# EAGLE design Adafruit ST7565 (EAGLE 7.2.0)
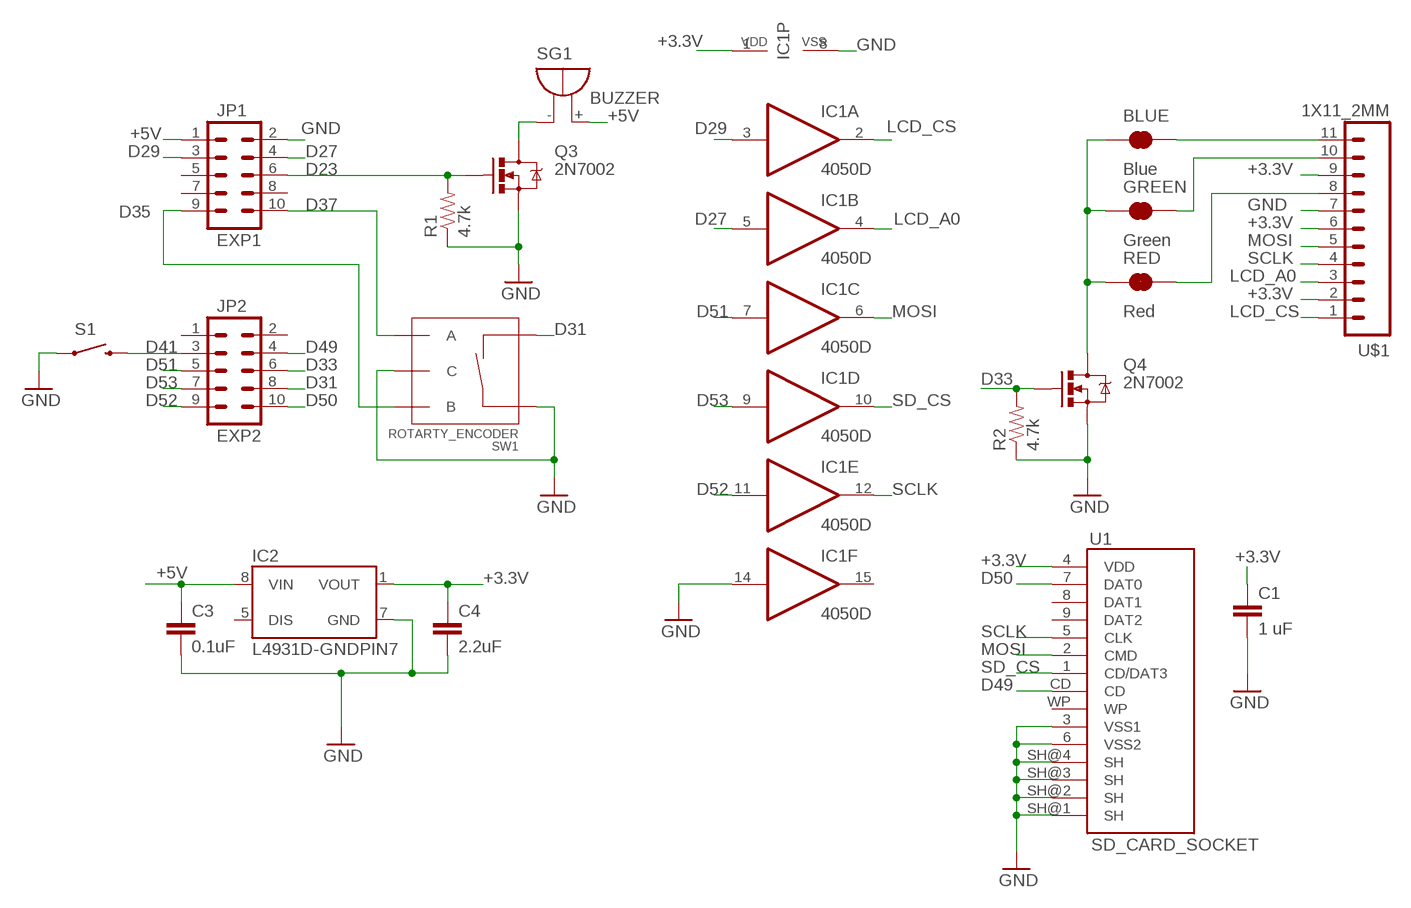
[diagram p0: schematic, sheet 1]

## Parts
BLUE  Blue  JUMPER-PAD-2-NC_BY_TRACE  [PAD-JUMPER-2-NC_BY_TRACE_YES_SILK]
C1  1 uF  CAP1206  [1206]
C3  0.1uF  CAP1206  [1206]
C4  2.2uF  CAP1206  [1206]
GREEN  Green  JUMPER-PAD-2-NC_BY_TRACE  [PAD-JUMPER-2-NC_BY_TRACE_YES_SILK]
IC1  4050D  [SO16]
IC2  L4931D-GNDPIN7  [SO08]
JP1  EXP1  M05X2SHD  [2X5-SHROUDED]
JP2  EXP2  M05X2SHD  [2X5-SHROUDED]
Q3  2N7002  MOSFET-NCHANNELBSS123LT1G  [SOT23-3]
Q4  2N7002  MOSFET-NCHANNELBSS123LT1G  [SOT23-3]
R1  4.7k  RESISTOR1206  [1206]
R2  4.7k  RESISTOR1206  [1206]
RED  Red  JUMPER-PAD-2-NC_BY_TRACE  [PAD-JUMPER-2-NC_BY_TRACE_YES_SILK]
S1  SWITCH-MOMENTARY-2PTH  [TACTILE-PTH]
SG1  BUZZER  [F/QMBIII]
SW1  ROTARTY_ENCODER  [ROTARY_ENC_PLAIN]
U1  SD_CARD_SOCKET  [SD_1:1]
U$1  1X11_2MM  [1X11_2MM]

## Nets
+3.3V: C1.1 C4.1 IC1.1(P:VDD) IC2.1(VOUT) U1.4(VDD) U$1.2 U$1.6 U$1.9
+5V: C3.1 IC2.8(VIN) JP1.1 SG1.+(-)
D23: JP1.6 Q3.1(G) R1.2
D27: IC1.5(B:I) JP1.4
D29: IC1.3(A:I) JP1.3
D31: JP2.8 SW1.SW-
D33: JP2.6 Q4.1(G) R2.2
D35: JP1.9 SW1.B
D37: JP1.10 SW1.A
D41: JP2.3 S1.3
D49: JP2.4 U1.CD
D50: JP2.10 U1.7(DAT0)
D51: IC1.7(C:I) JP2.5
D52: IC1.11(E:I) JP2.9
D53: IC1.9(D:I) JP2.7
GND: C1.2 C3.2 C4.2 IC1.8(P:VSS) IC1.14(F:I) IC2.7(GND) JP1.2 Q3.2(S) Q4.2(S) R1.1 R2.1 S1.1 SW1.C SW1.SW+ U1.3(VSS1) U1.6(VSS2) U1.SH@1(SH) U1.SH@2(SH) U1.SH@3(SH) U1.SH@4(SH) U$1.7
LCD_A0: IC1.4(B:O) U$1.3
LCD_CS: IC1.2(A:O) U$1.1
MOSI: IC1.6(C:O) U1.2(CMD) U$1.5
N$1: Q3.3(D) SG1.-(+)
N$2: BLUE.1 GREEN.1 Q4.3(D) RED.1
N$5: RED.2 U$1.8
N$6: GREEN.2 U$1.10
N$7: BLUE.2 U$1.11
SCLK: IC1.12(E:O) U1.5(CLK) U$1.4
SD_CS: IC1.10(D:O) U1.1(CD/DAT3)
Unconnected: IC1.15(F:O) IC2.5(DIS) JP1.5 JP1.7 JP1.8 JP2.1 JP2.2 U1.8(DAT1) U1.9(DAT2) U1.WP

## Library data of the parts
BLUE GREEN RED = SparkFun-Passives:JUMPER-PAD-2-NC_BY_TRACE
C1 C3 C4 = SparkFun-Passives:CAP: Capacitor Standard 0603 ceramic capacitor, and 0.1" leaded capacitor.
IC1 = 40xx:4050: Hex non-inverting BUFFER
IC2 = v-reg-3:L4931: STMicroelectronics <http://www.st.com> 250mA low dropout voltage regulator Vin 5V to 28V (transients 40V), disable pin, 50µA shutdown current
JP1 JP2 = SparkFun-Connectors:M05X2: Header 5x2 Standard 10-pin dual row 0.1" header. Commonly used with AVR-ISP. Use with Spark Fun Electronics SKU: PRT-00778
Q3 Q4 = SparkFun-DiscreteSemi:MOSFET-NCHANNEL: Common NMOSFET Parts MFG P/N Store ID Prod ID FDD8780 TRANS-09984 SI7820DN TRANS-11055 FDS6630A IC-08089 2N7002PW TRANS-11151 FQP30N06L COM-10213 TRANS-10060 BSS123LT1G TRANS-08345 BSS138 TRANS-00830 BS170 2N7000; PROD_ID: TRANS-08345
R1 R2 = SparkFun-Passives:RESISTOR: Resistor Basic schematic elements and footprints for 0603, 1206, and PTH resistors.
S1 = SparkFun-Electromechanical:SWITCH-MOMENTARY-2: Various NO switches- pushbuttons, reed, etc
SG1 = elb:BUZZER: BUZZER Source: Buerklin; OC_FARNELL: unknown; OC_NEWARK: unknown
SW1 = elb:ROTARTY_ENCODER: Simple no LED rotary encoder Example: COM-09117
U1 = elb:SD_CARD_SOCKET: SD Memory Card Connector, push-push normal type, CD enable, WP enable
U$1 = elb:1X11_2MM: !11-pin single row 2mm header

## Board
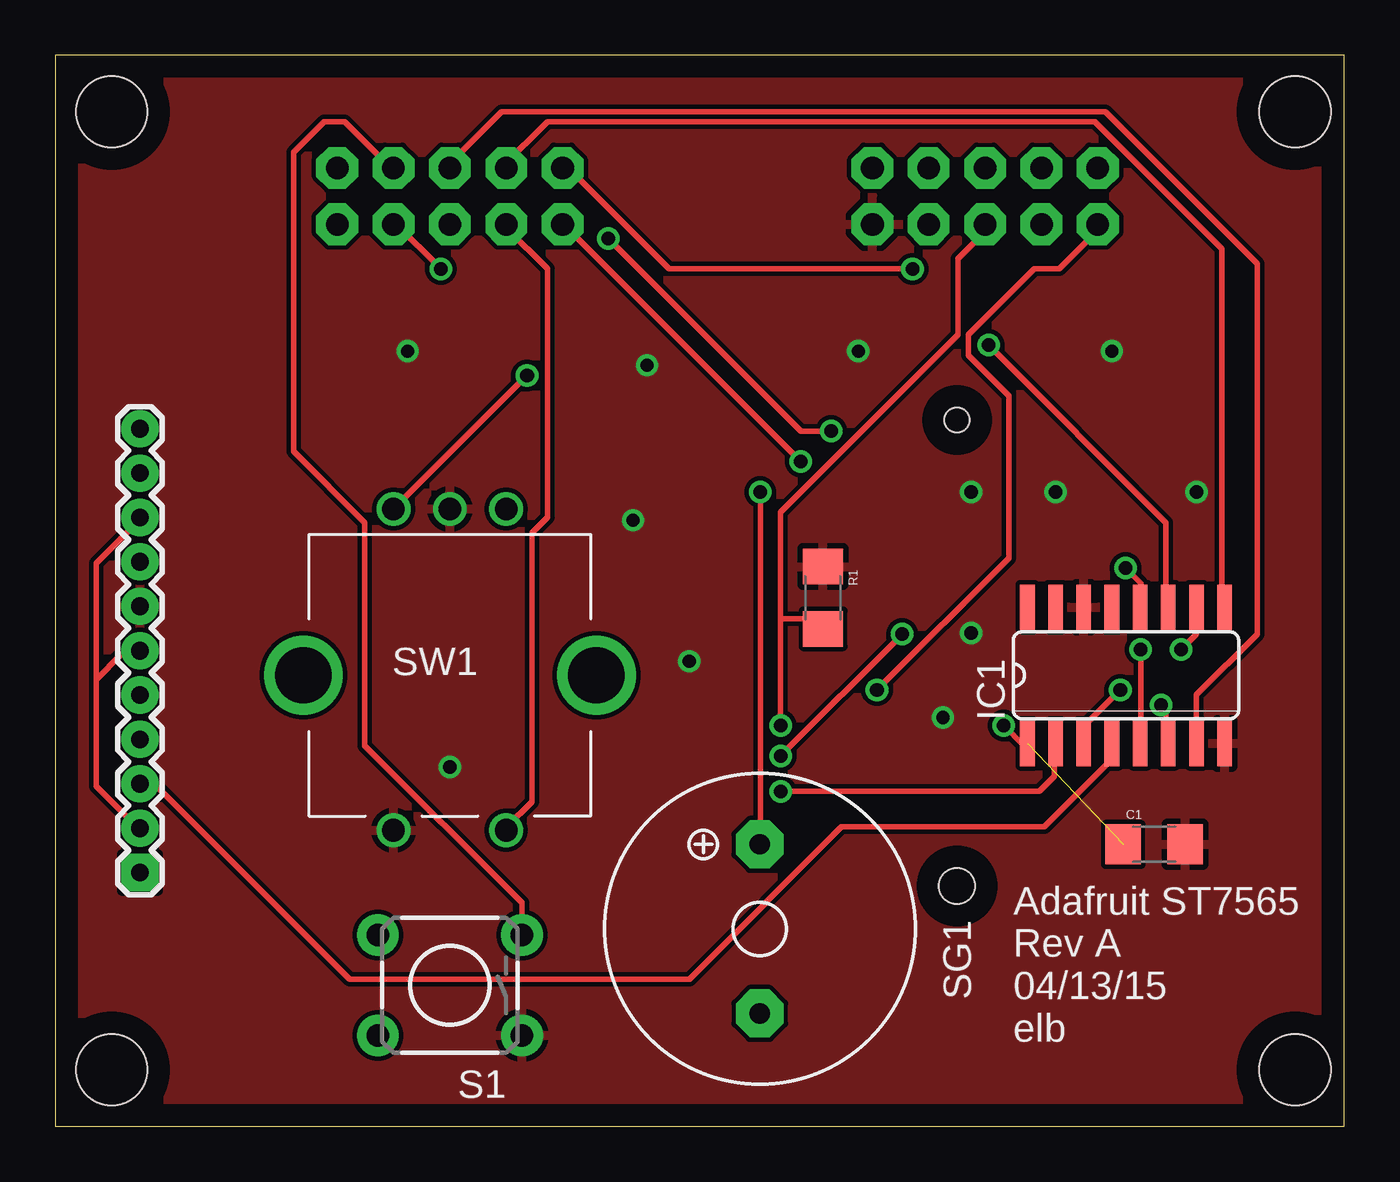
[diagram p1: board, top side]
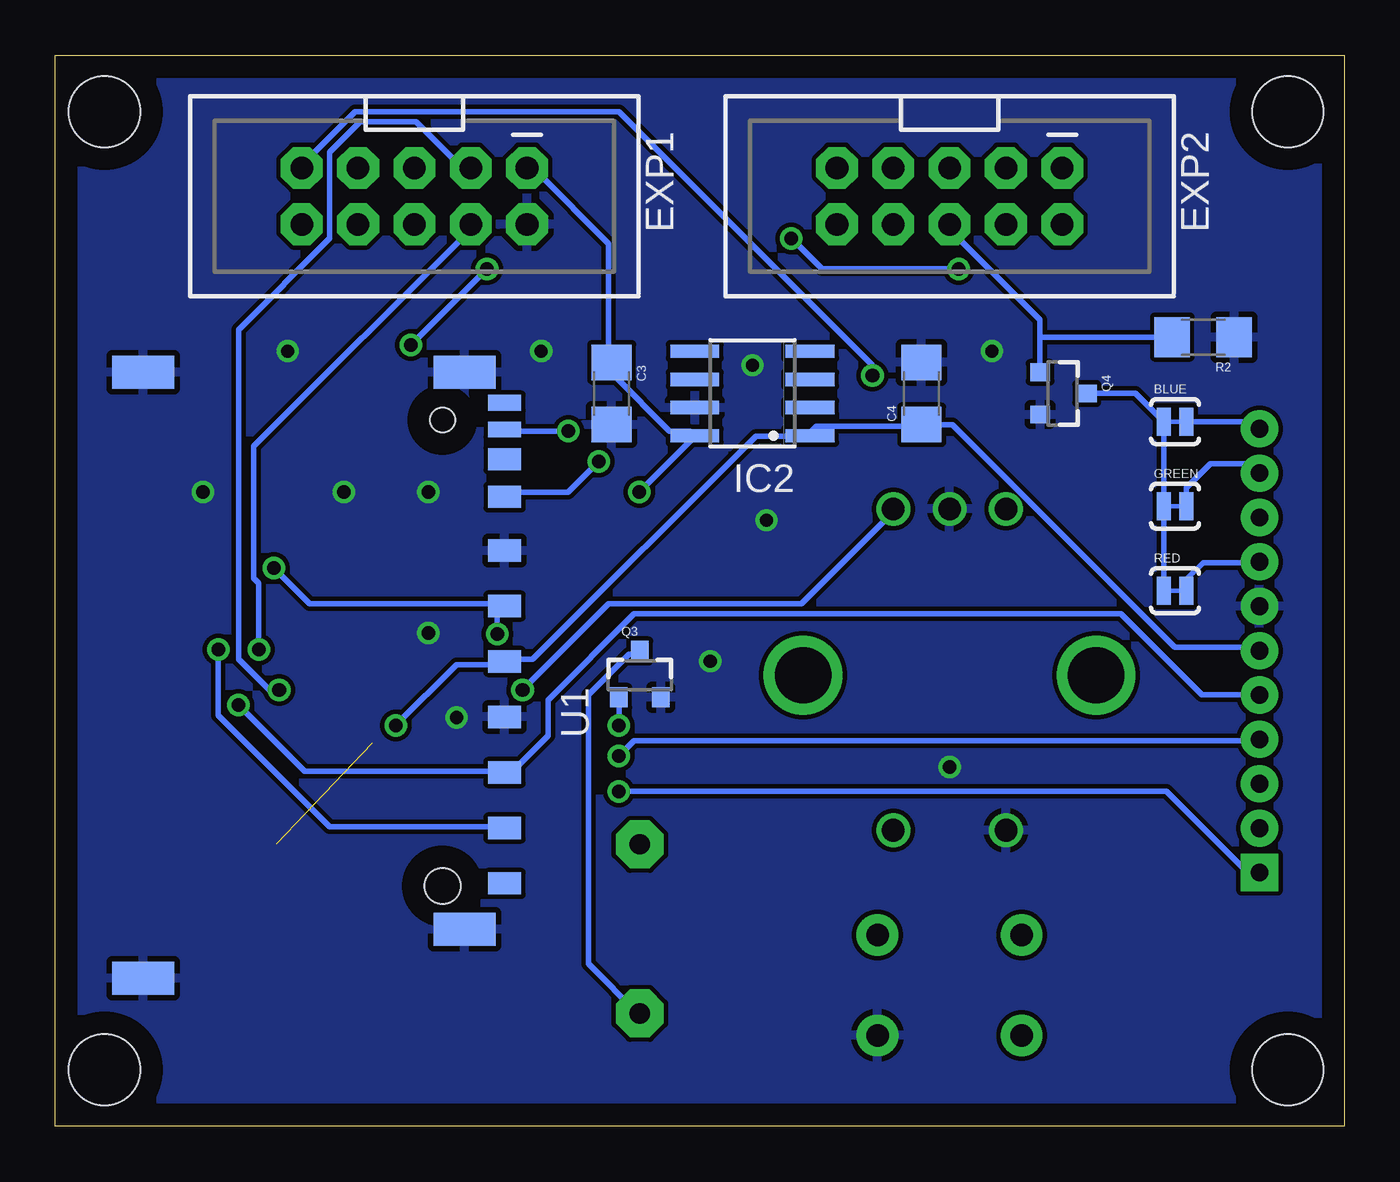
[diagram p2: board, bottom side, seen from below]

Size 58.09 x 48.25 mm. Coordinates in mm from the lower left corner, seen from the top.
Outline: 0,0 58.09,0 58.09,48.25 0,48.25 0,0
Copper layers (1*16): Top 0.035mm / dielectric 1.5mm / Bottom 0.035mm
Design rules "default": minimum track width 10mil, minimum drill 24mil, track to track 8mil, track to pad 8mil, pad to pad 8mil, via to via 8mil, smd to smd 8mil, copper to edge 40mil, drill to drill 8mil, minimum pad ring 10mil, minimum via ring 8mil, stop-mask expansion 4mil, vias tented up to drill 0mil, thermal gap 10mil
Holes 3.2 mm at 2.54,45.72 2.54,2.54 55.88,2.54 55.88,45.72

### Footprints (pad centres in the part's own frame; a part is rotated, then mirrored left to right if it is on the bottom)
PAD-JUMPER-2-NC_BY_TRACE_YES_SILK = smd 0.635 x 1.27: 1 -0.508,0; 2 0.508,0
1206 = smd 1.6 x 1.8: 1 -1.4,0; 2 1.4,0
SO16 = smd 0.66 x 2.032: 1 -4.445,-3.073; 2 -3.175,-3.073; 3 -1.905,-3.073; 4 -0.635,-3.073; 5 0.635,-3.073; 6 1.905,-3.073; 7 3.175,-3.073; 8 4.445,-3.073; 9 4.445,3.073; 10 3.175,3.073; 11 1.905,3.073; 12 0.635,3.073; 13 -0.635,3.073; 14 -1.905,3.073; 15 -3.175,3.073; 16 -4.445,3.073
SO08 = smd 0.6 x 2.2: 1 -1.905,-2.6; 2 -0.635,-2.6; 3 0.635,-2.6; 4 1.905,-2.6; 5 1.905,2.6; 6 0.635,2.6; 7 -0.635,2.6; 8 -1.905,2.6
2X5-SHROUDED = drill 1.016 pad 1.88 octagon: 1 -1.27,5.08; 2 1.27,5.08; 3 -1.27,2.54; 4 1.27,2.54; 5 -1.27,0; 6 1.27,0; 7 -1.27,-2.54; 8 1.27,-2.54; 9 -1.27,-5.08; 10 1.27,-5.08
SOT23-3 = smd 0.8 x 0.9: 1 -0.95,-1; 2 0.95,-1; 3 0,1.1
TACTILE-PTH = drill 1.016 pad 1.88: 1 -3.251,2.261; 2 3.251,2.261; 3 -3.251,-2.261; 4 3.251,-2.261
F/QMBIII = drill 0.914 pad 2.159 octagon: + 3.81,0; - -3.81,0
ROTARY_ENC_PLAIN = drill 1.016: A 7.493,-2.54; B 7.493,2.54; C 7.493,0; SW+ -6.985,2.54; SW- -6.985,-2.54 | drill 2.54: P$3 0,6.604; P$4 0,-6.604
SD_1:1 = smd 1 x 1.5: 1 6.88,2.8; 2 4.38,2.8; 3 1.88,2.8; 4 -0.62,2.8; 5 -3.12,2.8; 6 -5.62,2.8; 7 -8.04,2.8; 8 -9.74,2.8; 9 9.38,2.8 | smd 0.7 x 1.5: CD -11.08,2.8; WP -12.28,2.8 | smd 1.5 x 2.8: SH@1 11.45,1; SH@2 -13.65,-13.5; SH@3 13.65,-13.5; SH@4 -13.65,1 | hole 1.6: 9.5,0 | hole 1.1: -11.5,0
1X11_2MM = drill 0.8 pad 1.676 square: 1 0,0 | drill 0.8 pad 1.676: 2 2,0; 3 4,0; 4 6,0; 5 8,0; 6 10,0; 7 12,0; 8 14,0; 9 16,0; 10 18,0; 11 20,0

### Placement (x,y rotation side)
BLUE  7.62,31.75 0 bottom
C1  49.53,12.7 0 top
C3  33.02,33.02 270 bottom
C4  19.05,33.02 90 bottom
GREEN  7.62,27.94 0 bottom
IC1  48.26,20.32 0 top
IC2  26.67,33.02 90 bottom
JP1  41.91,41.91 270 bottom
JP2  17.78,41.91 270 bottom
Q3  31.75,20.32 0 bottom
Q4  12.7,33.02 270 bottom
R1  34.61,23.81 270 top
R2  6.35,35.56 180 bottom
RED  7.62,24.13 0 bottom
S1  17.78,6.35 180 top
SG1  31.75,8.89 90 top
SW1  17.78,20.32 90 top
U1  40.64,20.32 270 bottom
U$1  3.81,11.43 90 top

### Tracks (layer width: path | path; a pad name or v marks a point on that pad's centre or on a via)
+3.3V  (via drill 0.61)  (1 unrouted)
  Top 0.254: 1.83,20.12 1.83,15.32 3.66,13.49 U$1.2 | 1.83,20.12 2.97,21.26 3.66,21.26 U$1.6 | 1.83,20.12 1.83,25.38 3.66,27.2 U$1.9 | v42.75,18.06 43.66,17.14 IC1.1
  Bottom 0.254: v42.75,18.06 40.01,20.8 37.95,20.8 U1.4 37.72,21.03 36.58,21.03 26.52,31.09 24.23,31.09 IC2.1 24,31.32 23.77,31.55 19.2,31.55 C4.1 17.65,31.62 7.62,21.59 3.97,21.59 U$1.6
+5V  (via drill 0.61)
  Top 0.254: v31.77,28.57 31.77,12.8 SG1.+
  Bottom 0.254: JP1.1 36.8,42.98 36.35,42.98 33.15,39.78 33.15,34.52 C3.1 32.92,34.29 32.92,33.83 30.4,31.32 29.49,31.32 IC2.8 29.26,31.09 v31.77,28.57
D23  (via drill 0.61)
  Top 0.254: 32.69,22.86 32.69,27.66 40.69,35.66 40.69,39.09 42.06,40.46 JP1.6 | 32.69,22.86 v32.69,18.06 | R1.2 34.16,22.86 32.69,22.86
  Bottom 0.254: v32.69,18.06 32.69,19.2 Q3.1
D27  (via drill 0.61)
  Top 0.254: v48.92,21.49 48.92,17.37 IC1.5
  Bottom 0.254: v48.92,21.49 48.92,24.46 49.15,24.69 49.15,30.63 39.32,40.46 JP1.4
D29  (via drill 0.61)
  Top 0.254: v48.01,19.66 46.41,18.06 46.41,17.37 IC1.3
  Bottom 0.254: v48.01,19.66 48.46,19.66 49.84,21.03 49.84,35.89 45.72,40.01 45.72,43.89 44.35,45.26 41.83,45.26 39.55,42.98 JP1.3
D31
  Top 0.254: SW1.SW- 20.34,13.49 21.49,14.63 21.49,26.75 22.17,27.43 22.17,38.63 20.34,40.46 JP2.8
D33
  Bottom 0.254: 13.72,35.56 13.72,36.35 17.83,40.46 JP2.6 | 13.72,35.56 13.72,34.06 Q4.1 | R2.2 13.72,35.56
D35  (via drill 0.61)
  Top 0.254: v21.26,33.83 SW1.B
  Bottom 0.254: v21.26,33.83 21.26,34.29 32.69,45.72 44.58,45.72 47.09,43.2 JP1.9
D37  (via drill 0.61)
  Top 0.254: v37.03,19.66 42.98,25.6 42.98,32.92 41.15,34.75 41.15,35.66 44.12,38.63 45.26,38.63 47.09,40.46 JP1.10
  Bottom 0.254: v37.03,19.66 33.15,23.55 24.46,23.55 20.34,27.66 SW1.A
D41
  Top 0.254: S1.3 21.03,10.06 13.95,17.14 13.95,27.2 10.74,30.4 10.74,43.89 12.12,45.26 13.03,45.26 15.09,43.2 JP2.3
D49  (via drill 0.61)
  Top 0.254: v34.98,31.32 33.6,31.32 v24.92,40.01 | v17.37,38.63 15.32,40.69 JP2.4
  Bottom 0.254: v34.98,31.32 37.72,31.32 U1.CD | v24.92,40.01 23.55,38.63 v17.37,38.63
D50  (via drill 0.61)
  Top 0.254: v33.6,29.95 22.86,40.69 JP2.10
  Bottom 0.254: v33.6,29.95 34.98,28.57 37.72,28.57 U1.7
D51
  Top 0.254: IC1.7 51.44,19.43 54.18,22.17 54.18,38.86 47.32,45.72 20.12,45.72 17.6,43.2 JP2.5
D52  (via drill 0.61)
  Top 0.254: v42.06,35.2 50.06,27.2 50.06,23.55 IC1.11 | v38.63,38.63 27.66,38.63 23.32,42.98 22.86,42.98 JP2.9
  Bottom 0.254: v38.63,38.63 v42.06,35.2
D53
  Top 0.254: IC1.9 52.58,23.55 52.58,39.55 46.86,45.26 22.17,45.26 20.12,43.2 JP2.7
GND  (via drill 0.6)
  other vias: 36.2,34.92 45.09,28.57 41.27,28.57 51.44,28.57 41.27,22.23 47.62,34.92 26.04,27.3 26.67,34.29 15.88,34.92 17.78,16.19 40.01,18.41 28.57,20.95
  pour Bottom: -1.27,48.26 58.42,48.26 58.42,0 -1.27,0
  pour Top: -1.27,48.26 58.42,48.26 58.42,0 -1.27,0
LCD_A0
  Top 0.254: IC1.4 47.55,17.14 47.55,16.46 44.58,13.49 35.43,13.49 28.57,6.63 13.26,6.63 4.57,15.32 3.89,15.32 U$1.3
LCD_CS  (via drill 0.61)
  Top 0.254: v32.69,15.09 44.35,15.09 45.03,15.77 45.03,17.14 IC1.2
  Bottom 0.254: v32.69,15.09 8,15.09 4.34,11.43 U$1.1
MOSI  (via drill 0.61)
  Top 0.254: v49.84,18.97 50.06,18.75 50.06,17.37 IC1.6
  Bottom 0.254: v49.84,18.97 46.86,16 37.95,16 U1.2 37.72,15.77 35.89,17.6 35.89,19.2 32,23.09 10.06,23.09 6.4,19.43 3.89,19.43 U$1.5
N$1
  Bottom 0.254: Q3.3 31.77,21.26 32.23,21.26 34.06,19.43 34.06,7.32 31.77,5.03 SG1.-
N$2
  Bottom 0.254: Q4.3 9.4,33.02 BLUE.1 GREEN.1 RED.1
N$5
  Bottom 0.254: RED.2 7.11,24.64 6.35,25.4 3.84,25.4 U$1.8
N$6
  Bottom 0.254: GREEN.2 7.11,28.77 6.03,29.84 4.22,29.84 U$1.10
N$7
  Bottom 0.254: BLUE.2 4.13,31.75 U$1.11
SCLK  (via drill 0.61)
  Top 0.254: v48.23,25.15 48.92,24.46 48.92,23.55 IC1.12 | v38.18,22.17 v32.69,16.69
  Bottom 0.254: 38.18,23.55 46.63,23.55 v48.23,25.15 | 38.18,23.55 37.95,23.55 U1.5 38.18,23.55 | v32.69,16.69 32,17.37 3.89,17.37 U$1.4 | 38.18,23.55 v38.18,22.17
SD_CS  (via drill 0.61)
  Top 0.254: v50.75,21.49 51.44,22.17 IC1.10
  Bottom 0.254: v50.75,21.49 50.75,18.52 45.72,13.49 37.95,13.49 U1.1

### Text on the board
tNames: Adafruit ST7565 / Rev A / 04/13/15 / elb